# EAGLE schematic utility hat (EAGLE 6.3)
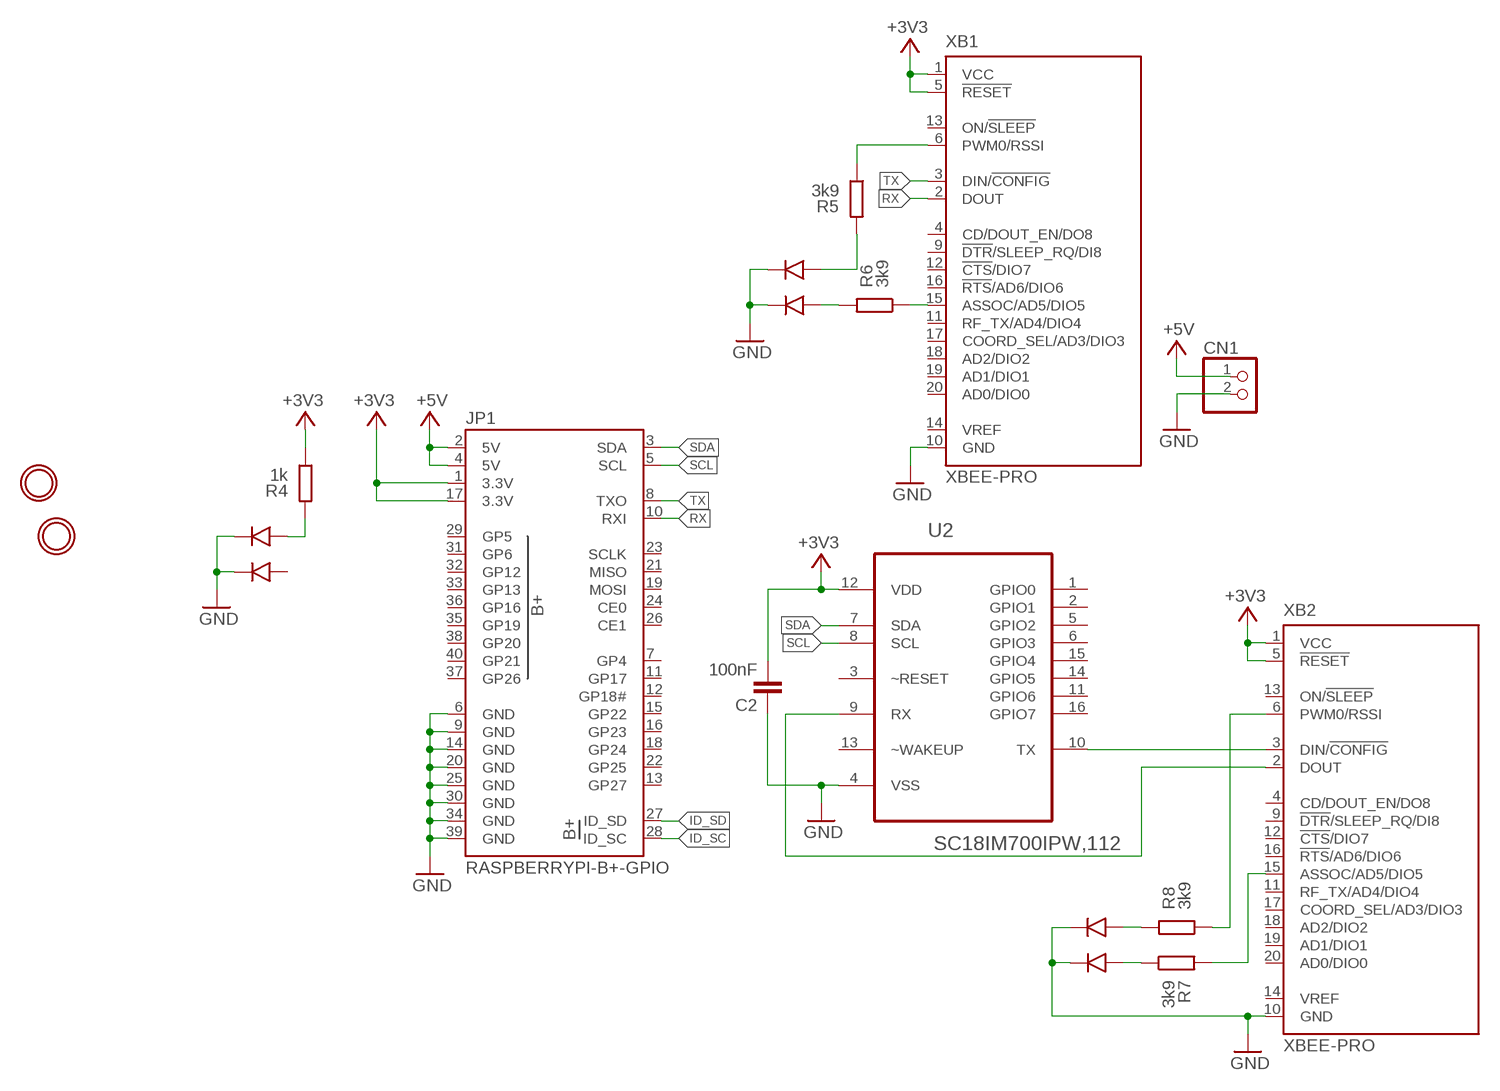
[diagram p0: schematic, sheet 1]

## Parts
C2  100nF  C-EUC0805K  [C0805K]
CN1  JST_2PIN  [JSTPH2]
JP1  RASPBERRYPI-B+-GPIO  [2X20-SHROUDED]
R4  1k  R-EU_M0805  [M0805]
R5  3k9  R-EU_M0805  [M0805]
R6  3k9  R-EU_M0805  [M0805]
R7  3k9  R-EU_M0805  [M0805]
R8  3k9  R-EU_M0805  [M0805]
U2  SC18IM700IPW,112  [SOP65P640X110-16N]
U$1  BI-LEVEL-LED-INDICATOR  [BI-LEVEL-LED-INDICATOR]
U$2  BI-LEVEL-LED-INDICATOR  [BI-LEVEL-LED-INDICATOR]
U$3  BI-LEVEL-LED-INDICATOR  [BI-LEVEL-LED-INDICATOR]
U$4  MOUNTINGHOLE3.0THIN  [MOUNTINGHOLE_3.0_PLATEDTHIN]
U$5  MOUNTINGHOLE3.0THIN  [MOUNTINGHOLE_3.0_PLATEDTHIN]
XB1  XBEE-PRO  [XBEE-PRO]
XB2  XBEE-PRO  [XBEE-PRO]

## Nets
+3V3: C2.2 JP1.1(3.3V) JP1.17(3.3V) R4.1 U2.12(VDD) XB1.1(VCC) XB1.5(!RESET) XB2.1(VCC) XB2.5(!RESET)
+5V: CN1.1 JP1.2(5V) JP1.4(5V)
GND: C2.1 CN1.2 JP1.6(GND) JP1.9(GND) JP1.14(GND) JP1.20(GND) JP1.25(GND) JP1.30(GND) JP1.34(GND) JP1.39(GND) U2.4(VSS) U$1.CATHODE1 U$1.CATHODE2 U$2.CATHODE1 U$2.CATHODE2 U$3.CATHODE1 U$3.CATHODE2 XB1.10(GND) XB2.10(GND)
ID_SC: JP1.28(ID_SC)
ID_SD: JP1.27(ID_SD)
N$1: U2.10(TX) XB2.3(DIN/!CONFIG)
N$2: U2.9(RX) XB2.2(DOUT)
N$4: R4.2 U$3.ANODE1
N$5: R6.1 XB1.15(ASSOC/AD5/DIO5)
N$6: R6.2 U$1.ANODE2
N$7: R5.1 XB1.6(PWM0/RSSI)
N$8: R5.2 U$1.ANODE1
N$9: R7.1 U$2.ANODE2
N$10: R8.2 U$2.ANODE1
N$11: R7.2 XB2.15(ASSOC/AD5/DIO5)
N$12: R8.1 XB2.6(PWM0/RSSI)
RX: JP1.10(RXI) XB1.2(DOUT)
SCL: JP1.5(SCL) U2.8(SCL)
SDA: JP1.3(SDA) U2.7(SDA)
TX: JP1.8(TXO) XB1.3(DIN/!CONFIG)
Unconnected: JP1.7(GP4) JP1.11(GP17) JP1.12(GP18#) JP1.13(GP27) JP1.15(GP22) JP1.16(GP23) JP1.18(GP24) JP1.19(MOSI) JP1.21(MISO) JP1.22(GP25) JP1.23(SCLK) JP1.24(CE0) JP1.26(CE1) JP1.29(GP5) JP1.31(GP6) JP1.32(GP12) JP1.33(GP13) JP1.35(GP19) JP1.36(GP16) JP1.37(GP26) JP1.38(GP20) JP1.40(GP21) U2.1(GPIO0) U2.2(GPIO1) U2.3(~RESET) U2.5(GPIO2) U2.6(GPIO3) U2.11(GPIO6) U2.13(~WAKEUP) U2.14(GPIO5) U2.15(GPIO4) U2.16(GPIO7) U$3.ANODE2 XB1.4(CD/DOUT_EN/DO8) XB1.9(!DTR!/SLEEP_RQ/DI8) XB1.11(RF_TX/AD4/DIO4) XB1.12(!CTS!/DIO7) XB1.13(ON/!SLEEP) XB1.14(VREF) XB1.16(!RTS!/AD6/DIO6) XB1.17(COORD_SEL/AD3/DIO3) XB1.18(AD2/DIO2) XB1.19(AD1/DIO1) XB1.20(AD0/DIO0) XB2.4(CD/DOUT_EN/DO8) XB2.9(!DTR!/SLEEP_RQ/DI8) XB2.11(RF_TX/AD4/DIO4) XB2.12(!CTS!/DIO7) XB2.13(ON/!SLEEP) XB2.14(VREF) XB2.16(!RTS!/AD6/DIO6) XB2.17(COORD_SEL/AD3/DIO3) XB2.18(AD2/DIO2) XB2.19(AD1/DIO1) XB2.20(AD0/DIO0)

## Library data of the parts
C2 = resistor:C-EU: CAPACITOR, European symbol; DIELECTRIC: X7R
CN1 = microbuilder:JST_2PIN: JST 2-Pin Right-Angle Connector PH-Series - 4UConnector: 17311 SH-Series - 4UConnector: 07278
JP1 = SparkFun-Boards:RASPBERRYPI-B+-GPIO: Raspberry Pi B+ GPIO Header 2x20 pin connector
R4-R8 = resistor:R-EU_: RESISTOR, European symbol; TOLERANCE: 5%
U2 = NXP_By_element14_Batch_1:SC18IM700IPW,112: Master I2C-bus controller with UART interface; MPN: SC18IM700IPW,112; OC_FARNELL: -; OC_NEWARK: 70R9006; PACKAGE: TSSOP-16; SUPPLIER: NXP
U$1-U$3 = unicorn_v2:BI-LEVEL-LED-INDICATOR
U$4 U$5 = microbuilder:MOUNTINGHOLE: Mounting Hole For #2 screws (0.086"/2.18mm width, 0.094"/2.4mm hole) use 2.5mm
XB1 XB2 = maxstream:XBEE: XBee (TM) /XBee-PRO(TM) OEM RF Modules Source: MaxStream, Inc. xbee_productmanual.pdf; MPN: XBP24-AWI-001; OC_FARNELL: 1337916; OC_NEWARK: 42M2667